# EAGLE schematic LoRaLo_V20-2 (EAGLE 7.5.0)
RFM95W
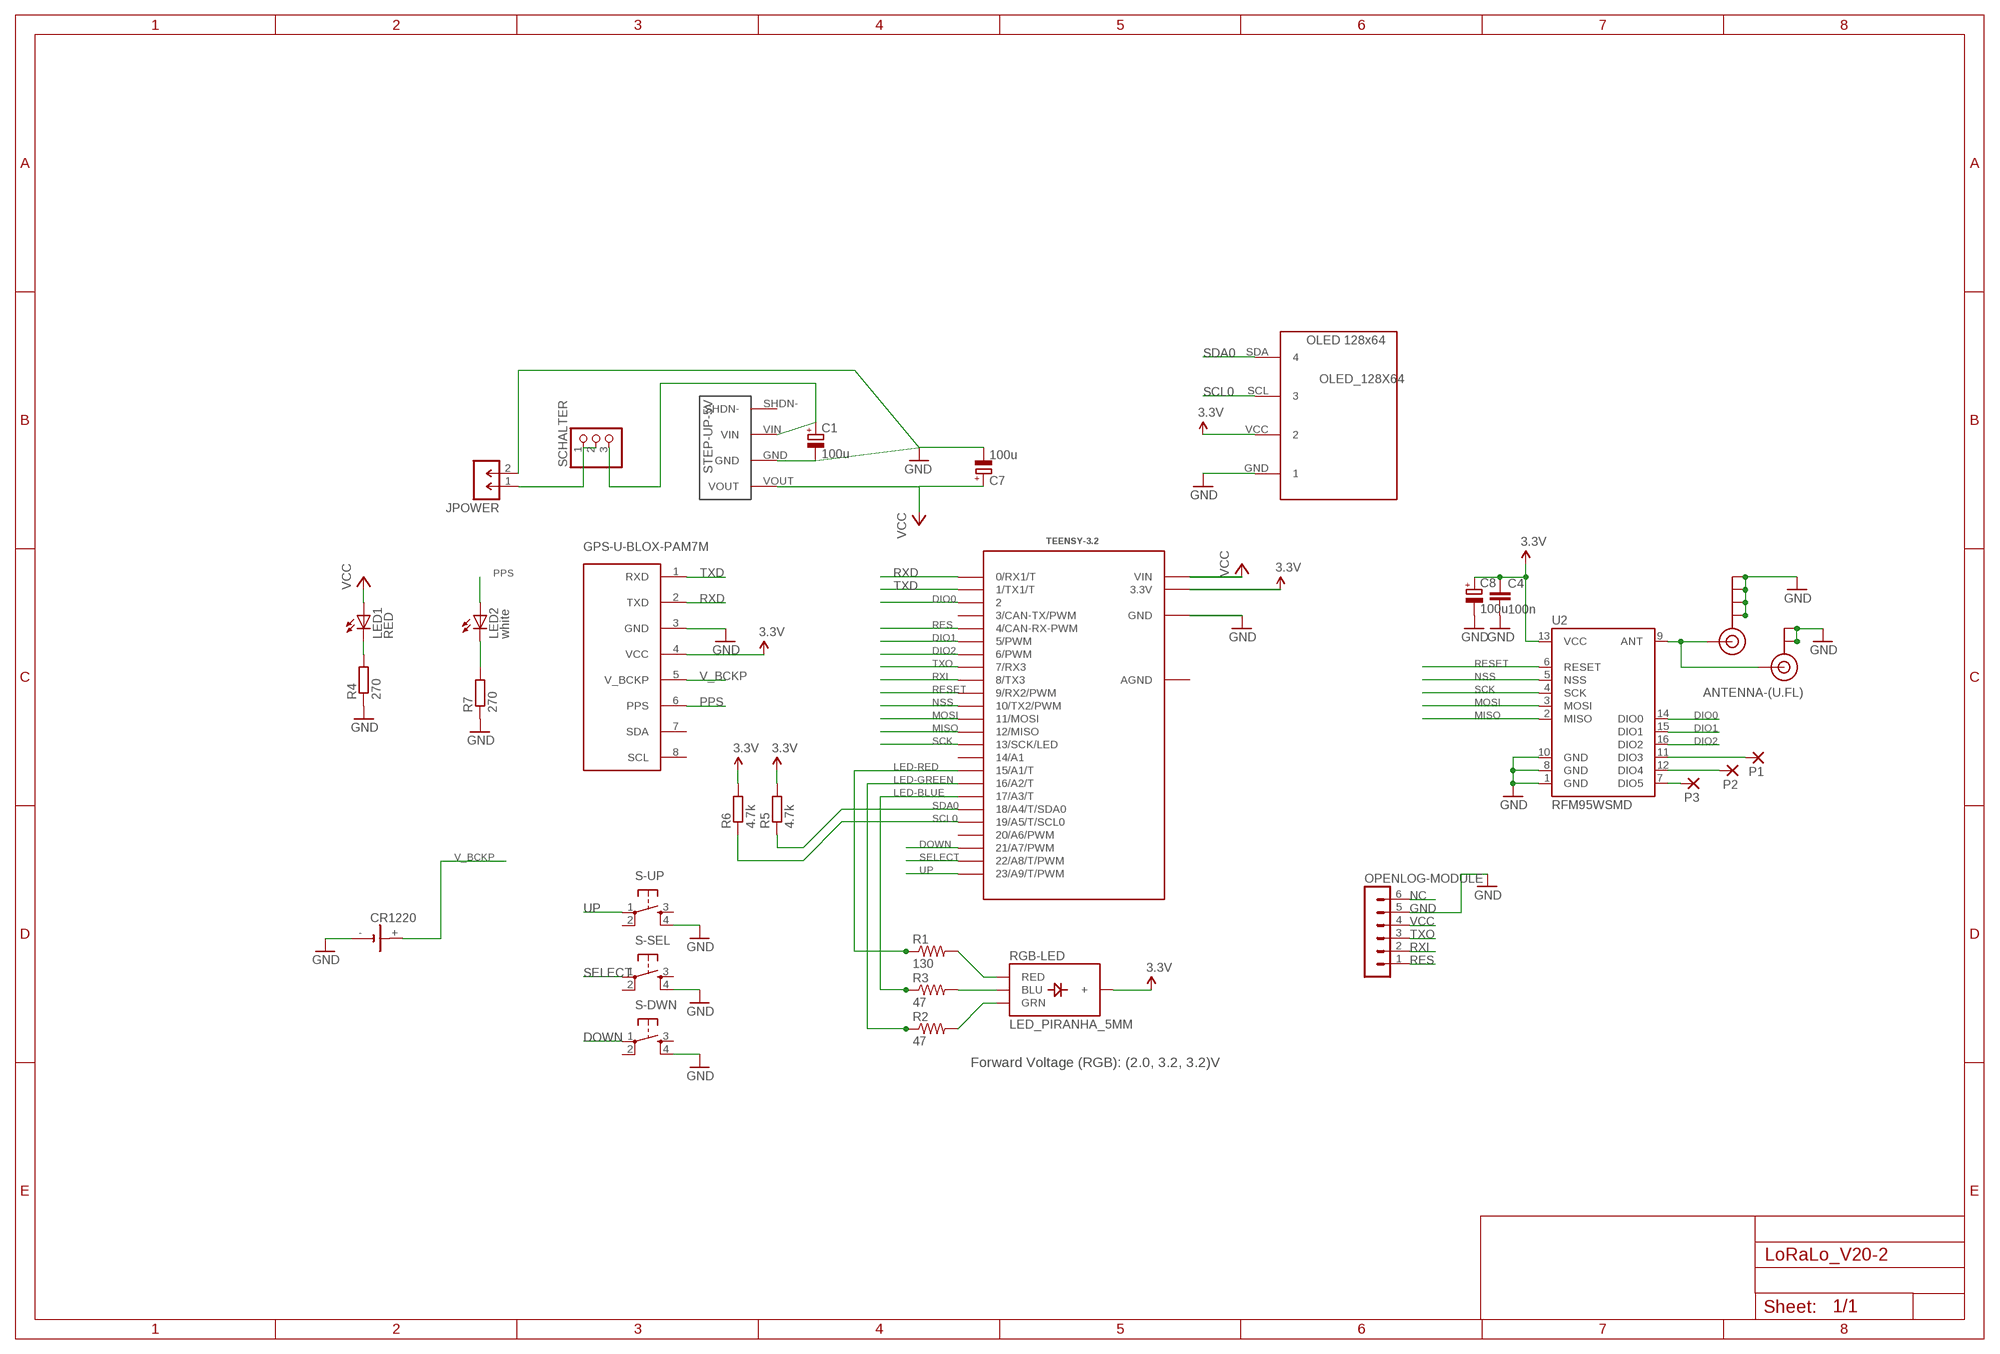
[diagram p0: schematic, sheet 1]

## Parts
ANTENNA-(EDGE-MOUNT)  SMA_EDGE  [SMA-EDGE]
ANTENNA-(U.FL)  U.FL  [U.FL]
C1  100u  CPOL-EUD  [PANASONIC_D]
C4  100n  C-EUC1206  [C1206]
C7  100u  CPOL-EUD  [PANASONIC_D]
C8  100u  CPOL-EUD  [PANASONIC_D]
CR1220  CH291-1220LF  [CH291-1220LF]
GPS-U-BLOX-PAM7M  U-BLOX-PAM-7Q  [U-BLOX-PAM-7Q]
JPOWER  M-1X02-SIP-100-40  [SIP-100-02-40]
LED1  RED  LED1206  [LED-1206]
LED2  white  LED1206  [LED-1206]
OLED_128X64  OLED_128X64  [OLED_128X64]
OPENLOG-MODULE  MA06-1  [MA06-1]
P1  1,6/0,8  [1,6/0,8]
P2  1,6/0,8  [1,6/0,8]
P3  1,6/0,8  [1,6/0,8]
R1  130  RESISTOR1206  [1206]
R2  47  RESISTOR1206  [1206]
R3  47  RESISTOR1206  [1206]
R4  270  R-EU_M1206  [M1206]
R5  4.7k  R-EU_M1206  [M1206]
R6  4.7k  R-EU_M1206  [M1206]
R7  270  R-EU_M1206  [M1206]
RGB-LED  LED_PIRANHA_5MM  [LED_PIRANHA_5MM]
S-DWN  TAC_SWITCHPTH  [TACTILE-PTH]
S-SEL  TAC_SWITCHPTH  [TACTILE-PTH]
S-UP  TAC_SWITCHPTH  [TACTILE-PTH]
SCHALTER  PINHD-1X3  [1X03]
STEP-UP-5V  POLOLU_STEP-UP  [POLOLU_STEP-UP]
TEENSY-3.2  TEENSY_3.1_DIL  [TEENSY3-DIL]
U2  RFM95WSMD  [RFM95W_SMD]

## Nets
3.3V [power]: C4.1 C8.+ GPS-U-BLOX-PAM7M.4(VCC) OLED_128X64.VCC R5.2 R6.2 RGB-LED.+ TEENSY-3.2.3.3V U2.13(VCC)
DIO0: TEENSY-3.2.2 U2.14(DIO0)
DIO1: TEENSY-3.2.5(5/PWM) U2.15(DIO1)
DIO2: TEENSY-3.2.6(6/PWM) U2.16(DIO2)
DOWN: S-DWN.1 TEENSY-3.2.21/A7(21/A7/PWM)
GND [power]: ANTENNA-(EDGE-MOUNT).GND@0(GND) ANTENNA-(EDGE-MOUNT).GND@1(GND) ANTENNA-(EDGE-MOUNT).GND@2(GND) ANTENNA-(EDGE-MOUNT).GND@3(GND) ANTENNA-(U.FL).P$1(GND) ANTENNA-(U.FL).P$2(GND) C1.- C4.2 C7.- C8.- CR1220.- GPS-U-BLOX-PAM7M.3(GND) JPOWER.2 OLED_128X64.GND OPENLOG-MODULE.5 R4.1 R7.1 S-DWN.4 S-SEL.4 S-UP.4 STEP-UP-5V.GND TEENSY-3.2.GND U2.1(GND) U2.8(GND) U2.10(GND)
LED-BLUE: R3.1 TEENSY-3.2.17/A3(17/A3/T)
LED-GREEN: R2.1 TEENSY-3.2.16/A2(16/A2/T)
LED-RED: R1.1 TEENSY-3.2.15/A1(15/A1/T)
MISO: TEENSY-3.2.12(12/MISO) U2.2(MISO)
MOSI: TEENSY-3.2.11(11/MOSI) U2.3(MOSI)
N$1: R1.2 RGB-LED.R(RED)
N$2: P1.1(P) U2.11(DIO3)
N$3: R2.2 RGB-LED.G(GRN)
N$4: C1.+ SCHALTER.3 STEP-UP-5V.VIN
N$5: ANTENNA-(EDGE-MOUNT).SIG(SIGNAL) ANTENNA-(U.FL).P$3(SIGNAL) U2.9(ANT)
N$6: P2.1(P) U2.12(DIO4)
N$7: P3.1(P) U2.7(DIO5)
N$9: R3.2 RGB-LED.B(BLU)
N$10: JPOWER.1 SCHALTER.1 SCHALTER.2
N$11: LED2.C R7.2
N$23: LED1.C R4.2
NC: OPENLOG-MODULE.6
NSS: TEENSY-3.2.10(10/TX2/PWM) U2.5(NSS)
PPS: GPS-U-BLOX-PAM7M.6(PPS) LED2.A
RES: OPENLOG-MODULE.1 TEENSY-3.2.4(4/CAN-RX-PWM)
RESET: TEENSY-3.2.9(9/RX2/PWM) U2.6(RESET)
RXD: GPS-U-BLOX-PAM7M.2(TXD) TEENSY-3.2.0(0/RX1/T)
RXI: OPENLOG-MODULE.2 TEENSY-3.2.8(8/TX3)
SCK: TEENSY-3.2.13(13/SCK/LED) U2.4(SCK)
SCL0: OLED_128X64.SCL R6.1 TEENSY-3.2.19/A5(19/A5/T/SCL0)
SDA0: OLED_128X64.SDA R5.1 TEENSY-3.2.18/A4(18/A4/T/SDA0)
SELECT: S-SEL.1 TEENSY-3.2.22/A8(22/A8/T/PWM)
TXD: GPS-U-BLOX-PAM7M.1(RXD) TEENSY-3.2.1(1/TX1/T)
TXO: OPENLOG-MODULE.3 TEENSY-3.2.7(7/RX3)
UP: S-UP.1 TEENSY-3.2.23/A9(23/A9/T/PWM)
V_BCKP: CR1220.+ GPS-U-BLOX-PAM7M.5(V_BCKP)
VCC [power]: C7.+ LED1.A OPENLOG-MODULE.4 STEP-UP-5V.VOUT TEENSY-3.2.VIN
Unconnected: GPS-U-BLOX-PAM7M.7(SDA) GPS-U-BLOX-PAM7M.8(SCL) S-DWN.2 S-DWN.3 S-SEL.2 S-SEL.3 S-UP.2 S-UP.3 STEP-UP-5V.SHDN- TEENSY-3.2.3(3/CAN-TX/PWM) TEENSY-3.2.14/A0(14/A1) TEENSY-3.2.20/A6(20/A6/PWM)

## Notes on the sheet
- Forward Voltage (RGB): (2.0, 3.2, 3.2)V

## Power pins joined to a net without a drawn wire
AGND: TEENSY-3.2.AGND

## Library data of the parts
ANTENNA-(EDGE-MOUNT) = SparkFun-Connectors:SMA_EDGE: SMA Antenna Connector End launch SMA connector. The paste layer has been removed so that the connector can be hand soldered onto the board after reflow.
ANTENNA-(U.FL) = SparkFun-Connectors:U.FL: SMD antenna connector- WRL-09144; PROD_ID: CONN-09193
C1 C7 C8 = rcl:CPOL-EU: POLARIZED CAPACITOR, European symbol
C4 = resistor:C-EU: CAPACITOR, European symbol
CR1220 = battery_mod:CH291-1220LF: Battery Holder, SMT, 12mm multicomp PART NO. CH291-1220LF Source: Data sheet <http://www.farnell.com/datasheets/1505860.pdf>
GPS-U-BLOX-PAM7M = u-blox:U-BLOX-PAM-7Q
JPOWER = con-headers-jp:M-1X02-: MALE HEADER
LED1 LED2 = SparkFun-LED:LED: LEDs Standard schematic elements and footprints for 5mm, 3mm, 1206, and 0603 sized LEDs. 5mm - Spark Fun Electronics SKU : COM-00529 (and others)
OLED_128X64 = OLED:OLED_128X64
OPENLOG-MODULE = con-lstb:MA06-1: PIN HEADER; OC_FARNELL: unknown; OC_NEWARK: unknown
P1-P3 = wirepad:1,6/0,8: THROUGH-HOLE PAD
R1-R3 = SparkFun-Passives:RESISTOR: Resistor Basic schematic elements and footprints for 0603, 1206, and PTH resistors.
R4-R7 = rcl:R-EU_: RESISTOR, European symbol
RGB-LED = SparkFun-LED_mod:LED_PIRANHA_5MM: High-brightness RGB through-hole LED, similar to that used in the Shiftbrite
S-DWN S-SEL S-UP = SparkFun-Retired:TAC_SWITCH: Momentary Switch Button commonly used for reset or general input. Spark Fun Electronics SKU : COM-00097 SMT- SWCH-08247
SCHALTER = pinhead:PINHD-1X3: PIN HEADER
STEP-UP-5V = Pololu_Step-Up:POLOLU_STEP-UP
TEENSY-3.2 = Teensy_3_and_LC_Series_Boards_v1.1:TEENSY_3.1_DIL: Teensy 3.1 or 3.2 in a DIL Layout.
U2 = misiek:RFM95W

## Net classes
0 default: width 0.12 mm
1 power: width 0.762 mm, drill 0.457 mm, clearance 0.457 mm